# EasyEDA Pro project PCB板子.epro

# Board PCB1
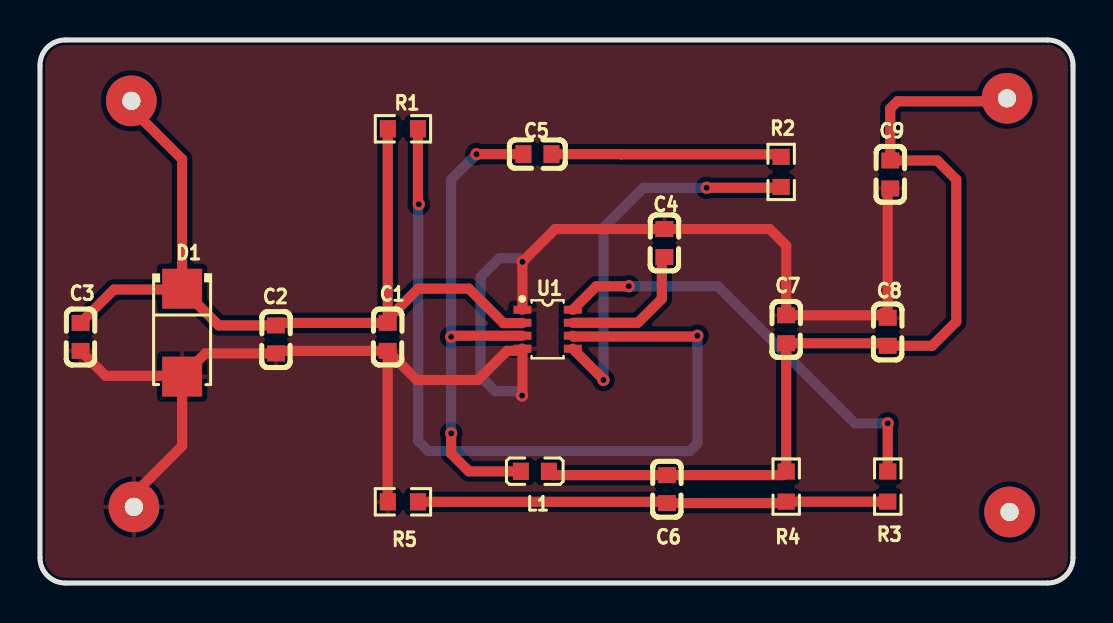
[diagram p0: board, top side]
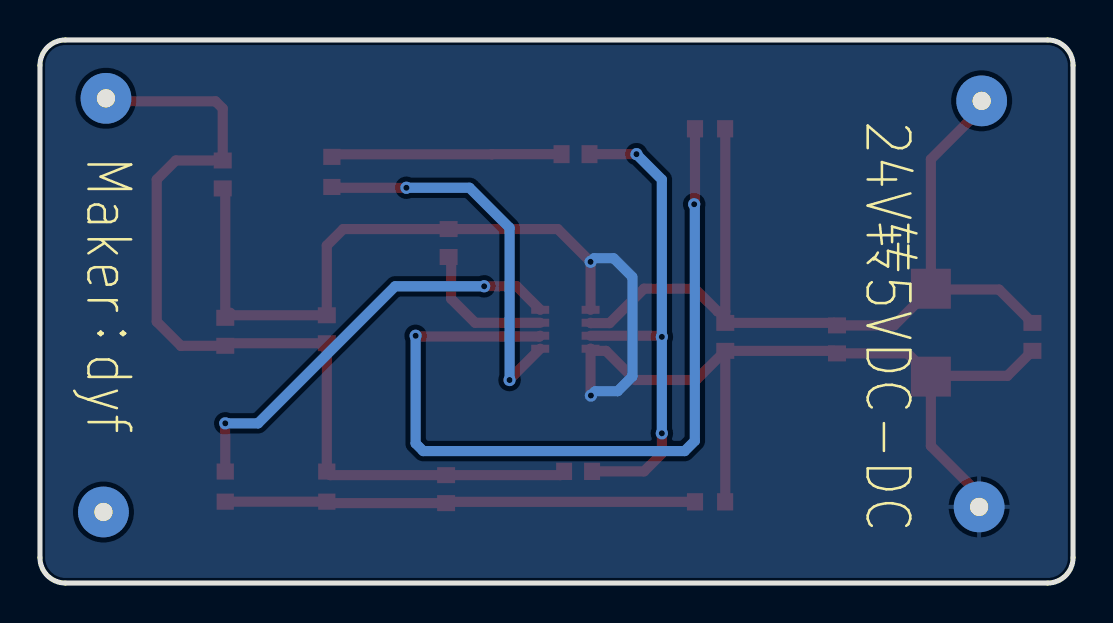
[diagram p1: board, bottom side, seen from below]

Outline 51.69 x 27.18 mm; copper layers: Top Layer, Bottom Layer. Coordinates in mm from the lower left corner of the outline.
Outline path: 0,25.91 0,1.27 arc(0.37,0.37) 1.27,0 50.42,0 arc(51.32,0.37) 51.69,1.27 51.69,25.91 arc(51.32,26.81) 50.42,27.18 1.27,27.18 arc(0.37,26.81) 0,25.91
Stack: Top Layer 0.035mm / Dielectric1 1.51mm FR4 er 4.5 / Bottom Layer 0.035mm

## Design rules (mm)
template: JLCPCB Capability(Two Layers Board)
spacing copperThickness1oz (default): track to track 0.102, other pairs 0.152 to 0.3
spacing copperThickness2oz: track to track 0.203, other pairs 0.152 to 0.3
track width copperThickness1oz (default): min 0.127, default 0.254, max 2.54
track width copperThickness2oz: min 0.203, default 0.254, max 2.54
differential pair differentialPair (default): width min 0.127, default 0.254, max 2.54; gap min 0.152, default 0.152
via viaSize (default): diameter min 0.5, default 0.61, max 10; hole min 0.3, default 0.305, max 6.3

## Placement (name value [footprint] x y rotation side)
C1  0.1uF  [C0603]  17.4 12.32 90 top
C2  22uF  [C0603]  11.81 12.19 90 top
C3  N/A  [C0603]  2.03 12.32 90 top
C4  0.1uF  [C0603]  31.24 17.02 270 top
C5  0.1uF  [C0603]  24.89 21.46 0 top
C6  33pF  [C0603]  31.37 4.7 90 top
C7  22uF  [C0603]  37.34 12.7 90 top
C8  22uF  [C0603]  42.42 12.57 90 top
C9  N/A  [C0603]  42.55 20.45 270 top
D1  SMAJ12A  [SMA_L4.3-W2.6-LS5.2-RD]  7.11 12.53 270 top
L1  4.7uH  [L0603]  24.77 5.59 0 top
NOREF  -  [Pad_e855]  48.51 3.56 0 top
NOREF#2  -  [Pad_e844]  48.39 24.26 0 top
NOREF#3  -  [Pad_e833]  4.7 3.81 0 top
NOREF#4  -  [Pad_e832]  4.57 24.13 0 top
R1  100K  [R0603]  18.16 22.73 0 top
R2  10  [R0603]  37.08 20.57 90 top
R3  20K  [R0603]  42.42 4.83 270 top
R4  40.2K  [R0603]  37.34 4.83 90 top
R5  7.5K  [R0603]  18.16 4.06 0 top
U1  MP2315SGJ-Z  [TSOT-23-8_L2.9-W1.6-P0.65-LS2.8-BL]  25.4 12.7 270 top

## Footprints (pads in the part's own frame, mm; a bottom-side part is the same pattern mirrored in y, then rotated)
C0603
  rect 0.8x0.9 smd: 1(-0.7,0) 2(0.7,0)
L0603
  rect 0.8x0.864 smd: 1(-0.7,0) 2(0.7,0)
Pad_e832
  round 2.54 hole 0.914: (0,0)
Pad_e833
  round 2.54 hole 0.914: (0,0)
Pad_e844
  round 2.54 hole 0.914: (0,0)
Pad_e855
  round 2.54 hole 0.914: (0,0)
R0603
  rect 0.806x0.864 smd: 1(-0.753,0) 2(0.753,0)
SMA_L4.3-W2.6-LS5.2-RD
  rect 2x2 smd: 1(-2.2,0) 2(2.2,0)
TSOT-23-8_L2.9-W1.6-P0.65-LS2.8-BL
  rect 0.4x0.9 smd: 1(-0.975,-1.26) 2(-0.325,-1.26) 3(0.325,-1.26) 4(0.975,-1.26) 5(0.975,1.26) 6(0.325,1.26) 7(-0.325,1.26) 8(-0.975,1.26)

## Nets
24V: C1.2 C2.2 C3.2 D1.1 NOREF#4. R1.1 U1.2
+5V: C6.2 C7.1 C8.1 C9.1 L1.2 NOREF#2. R4.2
GND: C1.1 C2.1 C3.1 C4.1 C7.2 C8.2 C9.2 D1.2 NOREF#3. R5.1 U1.1 U1.4
$1N2544: R1.2 U1.6
$1N3022: C4.2 U1.7
$1N3108: R2.1 U1.5
$1N3112: C5.2 R2.2
$1N3117: C5.1 L1.1 U1.3
$1N3580: C6.1 R3.2 R4.1 R5.2
$1N3608: R3.1 U1.8

## Via types
v1: diameter 0.61, hole 0.305, Top Layer to Bottom Layer, 11 vias

## Routing (per net, layer and track width the routed paths; a pad name or vN(x,y) marks a point on that pad's centre or on a via; arc(x,y) is an arc through that point)
24V: length 44.5
  Top Layer w0.508: 7.15,14.69 8.95,12.89 C2.2 11.94,13.02 17.4,13.02 17.4,13.59 ; 4.57,23.75 7.11,21.21 D1.1 ; 2.03,13.02 3.7,14.69 7.11,14.69 ; U1.2 24.12,13.01 23.19,13.01 21.46,14.73 18.92,14.73 17.78,13.59 17.4,13.59 ; 17.4,13.59 17.4,22.72 R1.1
+5V: length 47.1
  Top Layer w0.508: L1.2 25.65,5.4 C6.2 37.16,5.4 R4.2 C7.1 42.29,12 42.42,11.87 44.62,11.87 44.63,11.87 45.85,13.08 45.85,20.19 44.89,21.15 42.55,21.15 42.55,23.75 42.9,24.11 48.03,24.11 48.39,23.75
GND: length 83.2
  Top Layer w0.508: C1.1 18.86,10.16 21.91,10.16 23.37,11.62 24.03,11.62 U1.4 24.14,9.4 v1(24.12,9.38) ; C1.1 17.4,4.07 R5.1 ; C1.1 11.94,11.62 C2.1 8.28,11.49 7.15,10.37 ; C9.2 42.42,19.62 C8.2 42.29,13.4 ; 42.29,13.4 42.16,13.53 ; 42.29,13.4 C7.2 37.34,16.89 36.51,17.72 C4.1 25.78,17.72 v1(24.14,16.07) U1.1 ; 7.15,10.37 D1.2 7.11,6.86 4.7,4.44 ; 7.15,10.37 3.28,10.37 C3.1
  Bottom Layer w0.508: v1(24.12,9.38) 23.91,9.6 22.79,9.6 22.05,10.34 22.05,15.31 22.99,16.26 23.96,16.26 v1(24.14,16.07)
$1N2544: length 41.6
  Top Layer w0.508: R1.2 18.91,19 v1(18.96,18.96) ; U1.6 26.7,12.33 32.85,12.33 v1(32.89,12.38)
  Bottom Layer w0.508: v1(32.89,12.38) 32.89,6.98 32.51,6.6 19.43,6.6 18.92,7.11 18.92,18.92 v1(18.96,18.96)
$1N3022: length 7.1
  Top Layer w0.508: U1.7 29.92,13.02 31.12,14.22 31.12,16.19 C4.2
$1N3108: length 19.7
  Top Layer w0.508: 28.19,10.16 28.19,10.19 U1.5 ; v1(33.36,19.78) 37.05,19.78 37.22,19.94
  Bottom Layer w0.508: v1(33.36,19.78) 30.19,19.78 28.19,17.78 v1(28.19,10.16)
$1N3112: length 11.6
  Top Layer w0.508: 37.21,21.45 29.08,21.45 29.07,21.46 C5.2
$1N3117: length 25.3
  Top Layer w0.508: v1(20.57,12.32) 20.63,12.38 U1.3 ; v1(21.84,21.46) C5.1 ; v1(20.57,7.49) 20.57,6.48 21.46,5.59 24.06,5.59
  Bottom Layer w0.508: v1(21.84,21.46) 20.57,20.19 v1(20.57,12.32) v1(20.57,7.49)
$1N3580: length 23.7
  Top Layer w0.508: R5.2 31.05,4.06 31.12,4 37.26,4 R4.1 R3.2 42.29,4.2
$1N3608: length 21.5
  Top Layer w0.508: U1.8 27.84,14.85 v1(29.46,14.85) ; R3.1 v1(42.42,7.99)
  Bottom Layer w0.508: v1(29.46,14.85) 33.92,14.85 40.78,7.99 v1(42.42,7.99)

## Copper pours and planes (outline as drawn; the poured copper is in the pictures)
GND on Top Layer: -0.13,26.03 -0.11,26.23 -0.06,26.45 0.04,26.66 0.17,26.85 0.33,27.01 0.52,27.14 0.72,27.23 0.94,27.29 1.14,27.3 50.55,27.3 50.74,27.29 50.97,27.23 51.17,27.14 51.36,27.01 51.52,26.85 51.65,26.66 51.74,26.45 51.8,26.23 51.82,26.03 51.82,1.14 51.8,0.94 51.74,0.72 51.65,0.52 51.52,0.33 51.36,0.17 51.17,0.04 50.97,-0.06 50.74,-0.11 50.55,-0.13 1.14,-0.13 0.94,-0.11 0.72,-0.06 0.52,0.04 0.33,0.17 0.17,0.33 0.04,0.52 -0.06,0.72 -0.11,0.94 -0.13,1.14
GND on Bottom Layer: -0.13,26.03 -0.11,26.23 -0.06,26.45 0.04,26.66 0.17,26.85 0.33,27.01 0.52,27.14 0.72,27.23 0.94,27.29 1.14,27.3 50.55,27.3 50.74,27.29 50.97,27.23 51.17,27.14 51.36,27.01 51.52,26.85 51.65,26.66 51.74,26.45 51.8,26.23 51.82,26.03 51.82,1.14 51.8,0.94 51.74,0.72 51.65,0.52 51.52,0.33 51.36,0.17 51.17,0.04 50.97,-0.06 50.74,-0.11 50.55,-0.13 1.14,-0.13 0.94,-0.11 0.72,-0.06 0.52,0.04 0.33,0.17 0.17,0.33 0.04,0.52 -0.06,0.72 -0.11,0.94 -0.13,1.14

## Text on the board
Bottom Silkscreen Layer: 24V转5VDC-DC | Maker：dyf
